# Altium schematic sheet 03_Seven_Seg.SchDoc: ECE315 Analog
size A; Date: 4/25/2017; ApprovedBy: JSK; CheckedBy: JSK; Author: JSK; CompanyName: University of Wisconsin; DrawnBy: JSK; Engineer: JSK; Organization: ECE 315; Address1: College of Engineering; Address2: 1415 Engineering Drive; Address3: Madison, WI 53706; Address4: ECE 315 Fall 2017; Revision: A; SheetNumber: 3; SheetTotal: 11; AssemblyNumber: ECE315-F19; ApprovedDate: 04/02/2019
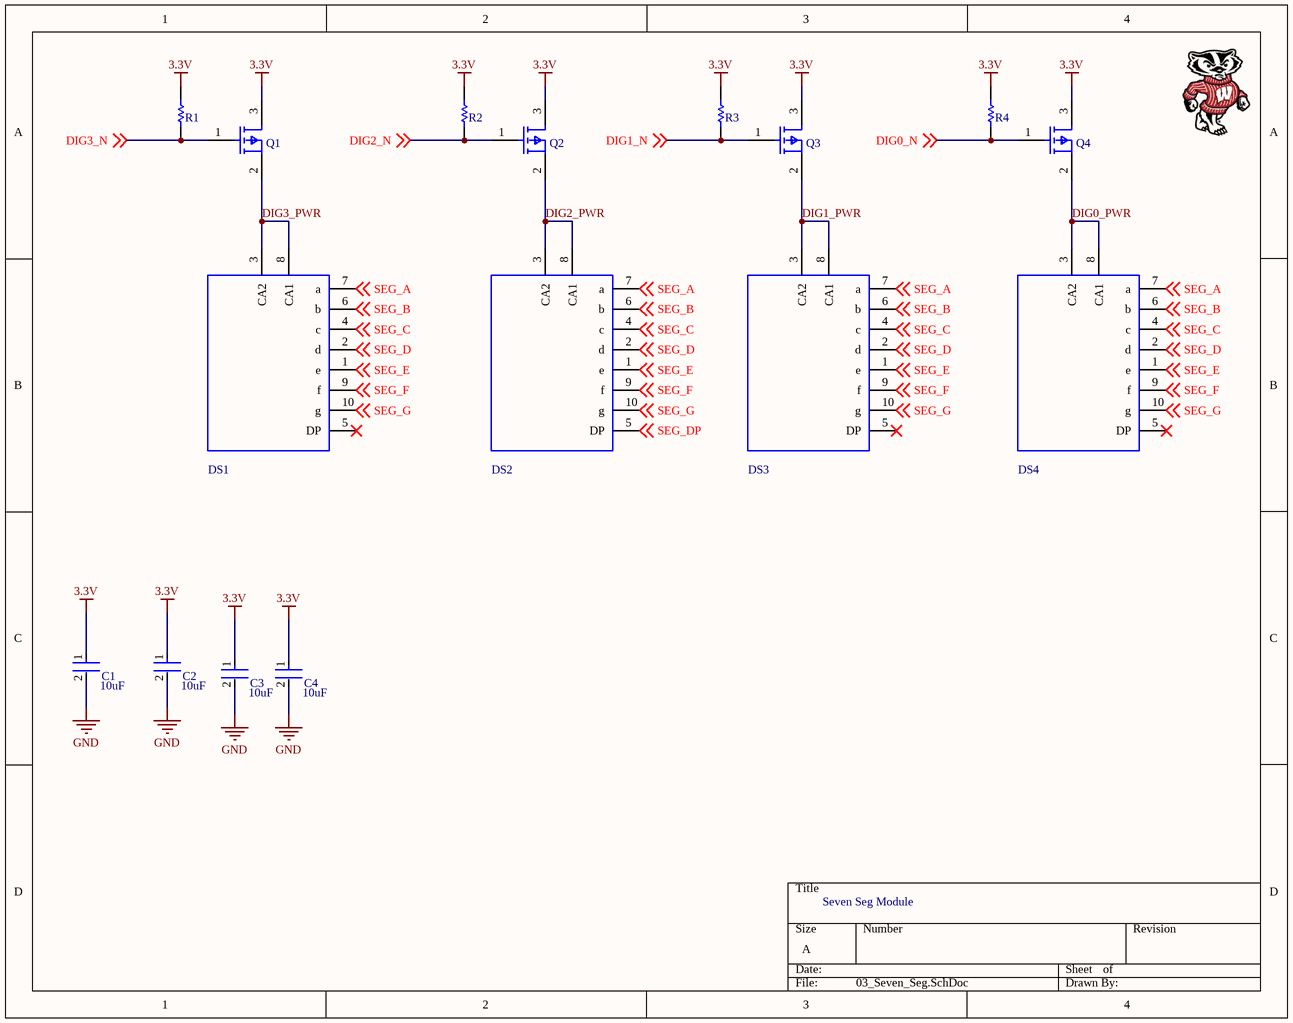
[diagram p0: 03_Seven_Seg.SchDoc]

## Parts
C1  Capacitance: 10uF  [FP-CL21-IPC_B]  (hidden comment: CL21A106KQCLNNC)
C2  Capacitance: 10uF  [FP-CL21-IPC_B]  (hidden comment: CL21A106KQCLNNC)
C3  Capacitance: 10uF  [FP-CL21-IPC_B]  (hidden comment: CL21A106KQCLNNC)
C4  Capacitance: 10uF  [FP-CL21-IPC_B]  (hidden comment: CL21A106KQCLNNC)
DS1  ACSA56-41CGKWA-F01  [ACSA56-41CGKWA-F01]  (value not drawn)
DS2  ACSA56-41CGKWA-F01  [ACSA56-41CGKWA-F01]  (value not drawn)
DS3  ACSA56-41CGKWA-F01  [ACSA56-41CGKWA-F01]  (value not drawn)
DS4  ACSA56-41CGKWA-F01  [ACSA56-41CGKWA-F01]  (value not drawn)
Q1  SSM3J133TU  [UFM_TOS]  (value not drawn)
Q2  SSM3J133TU  [UFM_TOS]  (value not drawn)
Q3  SSM3J133TU  [UFM_TOS]  (value not drawn)
Q4  SSM3J133TU  [UFM_TOS]  (value not drawn)
R1  RES_0805_K_010.00  [RES_0805]  (value not drawn)
R2  RES_0805_K_010.00  [RES_0805]  (value not drawn)
R3  RES_0805_K_010.00  [RES_0805]  (value not drawn)
R4  RES_0805_K_010.00  [RES_0805]  (value not drawn)

## Nets
3.3V: C1.1 C2.1 C3.1 C4.1 Q1.3(Drain) Q2.3(Drain) Q3.3(Drain) Q4.3(Drain) R1.2 R2.2 R3.2 R4.2
GND: C1.2 C2.2 C3.2 C4.2
DIG0_N: Q4.1(Gate) R4.1 ; off-sheet DIG0_N
DIG0_PWR: DS4.3(CA2) DS4.8(CA1) Q4.2(Source)
DIG1_N: Q3.1(Gate) R3.1 ; off-sheet DIG1_N
DIG1_PWR: DS3.3(CA2) DS3.8(CA1) Q3.2(Source)
DIG2_N: Q2.1(Gate) R2.1 ; off-sheet DIG2_N
DIG2_PWR: DS2.3(CA2) DS2.8(CA1) Q2.2(Source)
DIG3_N: Q1.1(Gate) R1.1 ; off-sheet DIG3_N
DIG3_PWR: DS1.3(CA2) DS1.8(CA1) Q1.2(Source)
SEG_A: DS1.7(a) DS2.7(a) DS3.7(a) DS4.7(a) ; off-sheet SEG_A
SEG_B: DS1.6(b) DS2.6(b) DS3.6(b) DS4.6(b) ; off-sheet SEG_B
SEG_C: DS1.4(c) DS2.4(c) DS3.4(c) DS4.4(c) ; off-sheet SEG_C
SEG_D: DS1.2(d) DS2.2(d) DS3.2(d) DS4.2(d) ; off-sheet SEG_D
SEG_DP: DS2.5(DP) ; off-sheet SEG_DP
SEG_E: DS1.1(e) DS2.1(e) DS3.1(e) DS4.1(e) ; off-sheet SEG_E
SEG_F: DS1.9(f) DS2.9(f) DS3.9(f) DS4.9(f) ; off-sheet SEG_F
SEG_G: DS1.10(g) DS2.10(g) DS3.10(g) DS4.10(g) ; off-sheet SEG_G

Not connected (* = marked no-connect by the designer): DS1 5(DP)*; DS3 5(DP)*; DS4 5(DP)*

## Notes on the sheet
- Seven Seg Module

## Library data of the parts
C1-C4 = CMP-13271-003047-1: CL21 Series 0805 10uF 6.3V ±10% Tolerance X5R Multilayer Ceramic Chip Capacitor; Lead Free: Lead Free; Mount: Surface Mount; Case/Package: 0805; Packaging: Tape and Reel; Max Operating Temperature: 85°C; Min Operating Temperature: -55°C; Voltage Rating: 6.3V; Case Code (Metric): 2012; Radiation Hardening: No; Tolerance: 10%; Package Quantity: 1; Depth: 1.25mm; Width: 0.049inch; Dielectric: X5R; Height: 0.85mm; Case Code (Imperial): 0805; Length: 2mm; Thickness: 0.037inch
DS1-DS4 = ACSA56-41CGKWA-F01: DISPLAY 0.56" SGL 574NM GRN SMD; Manufacturer 1: Kingbright; Color: Green; Power Consumption: 75mW; Number of Characters: 1; Element Configuration: Common Anode; Forward Current: 30mA; Forward Voltage: 2.1V; Wavelength: 570nm; Test Current: 20mA; Luminous Intensity: 25mcd; Display Type: Segment; Supplier 1: Digi-Key; Supplier Part Number 1: 754-1033-1-ND; Manufacturer Part Number 1: ACSA56-41CGKWA-F01; RoHS: Yes; Category: LED Displays; Stock 1: 38128; Pricing 1: 1=3.38000, 10=2.25300, 100=1.73360 (USD); Case/Package: SMD/SMT; Min Operating Temperature: -40°C; Max Operating Temperature: 85°C; Package Quantity: 400; Max Power Dissipation: 75mW; Illumination Color: Green; Packaging: Rail/Tube; Operating Supply Voltage: 2.1V; Width: 0.488inch; Height: 0.669inch; RoHS Compliant: Yes; Lead Free: Lead Free; ComponentLink1URL: https://datasheet.ciiva.com/2103/acsa56-41cgkwa-f01-2103794.pdf?src-supplier=Digi-Key; ComponentLink1Description: https://datasheet.ciiva.com/2103/acsa56-41cgkwa-f01-2103794.pdf?src-supplier=Digi-Key; ComponentLink2URL: https://datasheet.ciiva.com/4421/acsa56-41cgkwa-f01-17964-4421697.pdf?src-supplier=Mouser; ComponentLink2Description: https://datasheet.ciiva.com/4421/acsa56-41cgkwa-f01-17964-4421697.pdf?src-supplier=Mouser; ComponentLink3URL: https://datasheet.ciiva.com/16287/acsa56-41cgkwa-f01-16287523.pdf?src-supplier=Future+Electronics; ComponentLink3Description: https://datasheet.ciiva.com/16287/acsa56-41cgkwa-f01-16287523.pdf?src-supplier=Future+Electronics; ComponentLink4URL: https://datasheet.ciiva.com/2103/acsa56-41cgkwa-f01-2103795.pdf?src-supplier=Digi-Key; ComponentLink4Description: https://datasheet.ciiva.com/2103/acsa56-41cgkwa-f01-2103795.pdf?src-supplier=Digi-Key; ComponentLink5URL: https://datasheet.ciiva.com/2103/acsa56-41cgkwa-f01-2103796.pdf?src-supplier=Digi-Key; ComponentLink5Description: https://datasheet.ciiva.com/2103/acsa56-41cgkwa-f01-2103796.pdf?src-supplier=Digi-Key
Q1-Q4 = SSM3J133TU: MOSFET P-CH 20V 4.4A UFM; Mfr_Name: Toshiba Electronic Devices & Storage Corp.; Type: DEV; Copyright: Copyright (C) 2022 Ultra Librarian. All rights reserved.; Manufacturer_Part_Number: SSM3J133TU; Digi-Key_Part_Number_1: SSM3J133TULFCT-ND; Digi-Key_Part_Number_2: SSM3J133TULFDKR-ND; Digi-Key_Part_Number_3: SSM3J133TULFTR-ND; RefDes: RefDes; Supplier 1: Digi-Key; Supplier Part Number 1: SSM3J133TULFCT-ND
R1-R4 = RES_0805_K_010.00: RES SMD 10K OHM 1% 1/8W 0805; Manufacturer 1: Yageo; Manufacturer Part Number 1: RC0805FR-0710KL; Temperature Coefficient: 100ppm/°C; Power Rating: 125mW; Voltage Rating: 150V; Resistance: 10kR; Supplier 1: Digi-Key; Supplier Part Number 1: 311-10.0KCRCT-ND; Stock 1: 7562122; Pricing 1: 1=0.10000, 10=0.04200, 100=0.01690, 1000=0.00759, 2500=0.00659 (USD); RoHS: Yes; Case/Package: 0805; Case Code (Imperial): 0805; Case Code (Metric): 2012; Min Operating Temperature: -55°C; Max Operating Temperature: 155°C; Tolerance: 1%; Packaging: Tape and Reel; Features: Moisture Resistant; Termination: SMD/SMT; Number of Terminations: 2; Military Standard: Not; Max Power Dissipation: 125mW; Package Quantity: 1; Length: 2mm; Height: 0.024inch; Width: 0.049inch; Depth: 1.25mm; Lead Free: Lead Free; REACH SVHC: Unknown; ComponentLink1URL: https://datasheet.ciiva.com/11808/0900766b8106beab-11808151.pdf?src-supplier=RSComponents; ComponentLink1Description: https://datasheet.ciiva.com/11808/0900766b8106beab-11808151.pdf?src-supplier=RSComponents; ComponentLink2URL: https://datasheet.ciiva.com/12669/rc0805-12669688.pdf?src-supplier=Mouser; ComponentLink2Description: https://datasheet.ciiva.com/12669/rc0805-12669688.pdf?src-supplier=Mouser; ComponentLink3URL: https://datasheet.ciiva.com/46447/444164-46447563.pdf?src-supplier=Element14; ComponentLink3Description: https://datasheet.ciiva.com/46447/444164-46447563.pdf?src-supplier=Element14; ComponentLink4URL: https://datasheet.ciiva.com/2456/pyu-r-int-thick-7-2456972.pdf?src-supplier=Digi-Key; ComponentLink4Description: https://datasheet.ciiva.com/2456/pyu-r-int-thick-7-2456972.pdf?src-supplier=Digi-Key; ComponentLink5URL: https://datasheet.ciiva.com/2456/pyu-r-int-thick-7-2456973.pdf?src-supplier=Digi-Key; ComponentLink5Description: https://datasheet.ciiva.com/2456/pyu-r-int-thick-7-2456973.pdf?src-supplier=Digi-Key; ComponentLink6URL: https://datasheet.ciiva.com/2456/pyu-r-int-thick-7-2456974.pdf?src-supplier=Digi-Key; ComponentLink6Description: https://datasheet.ciiva.com/2456/pyu-r-int-thick-7-2456974.pdf?src-supplier=Digi-Key; ComponentLink7URL: https://datasheet.ciiva.com/16747/rc0805-16747087.pdf?src-supplier=Future+Electronics; ComponentLink7Description: https://datasheet.ciiva.com/16747/rc0805-16747087.pdf?src-supplier=Future+Electronics; Category: Chip SMD Resistors; Size Code: 0805; Resistor Type: Thick Film; Series: RC; Construction: Rectangular; Resistance Tolerance: 1%; Technology: THICK FILM; RoHS Compliant: Yes